# EAGLE design DropScreenMay2016DriversBoard (EAGLE 7.1.0)
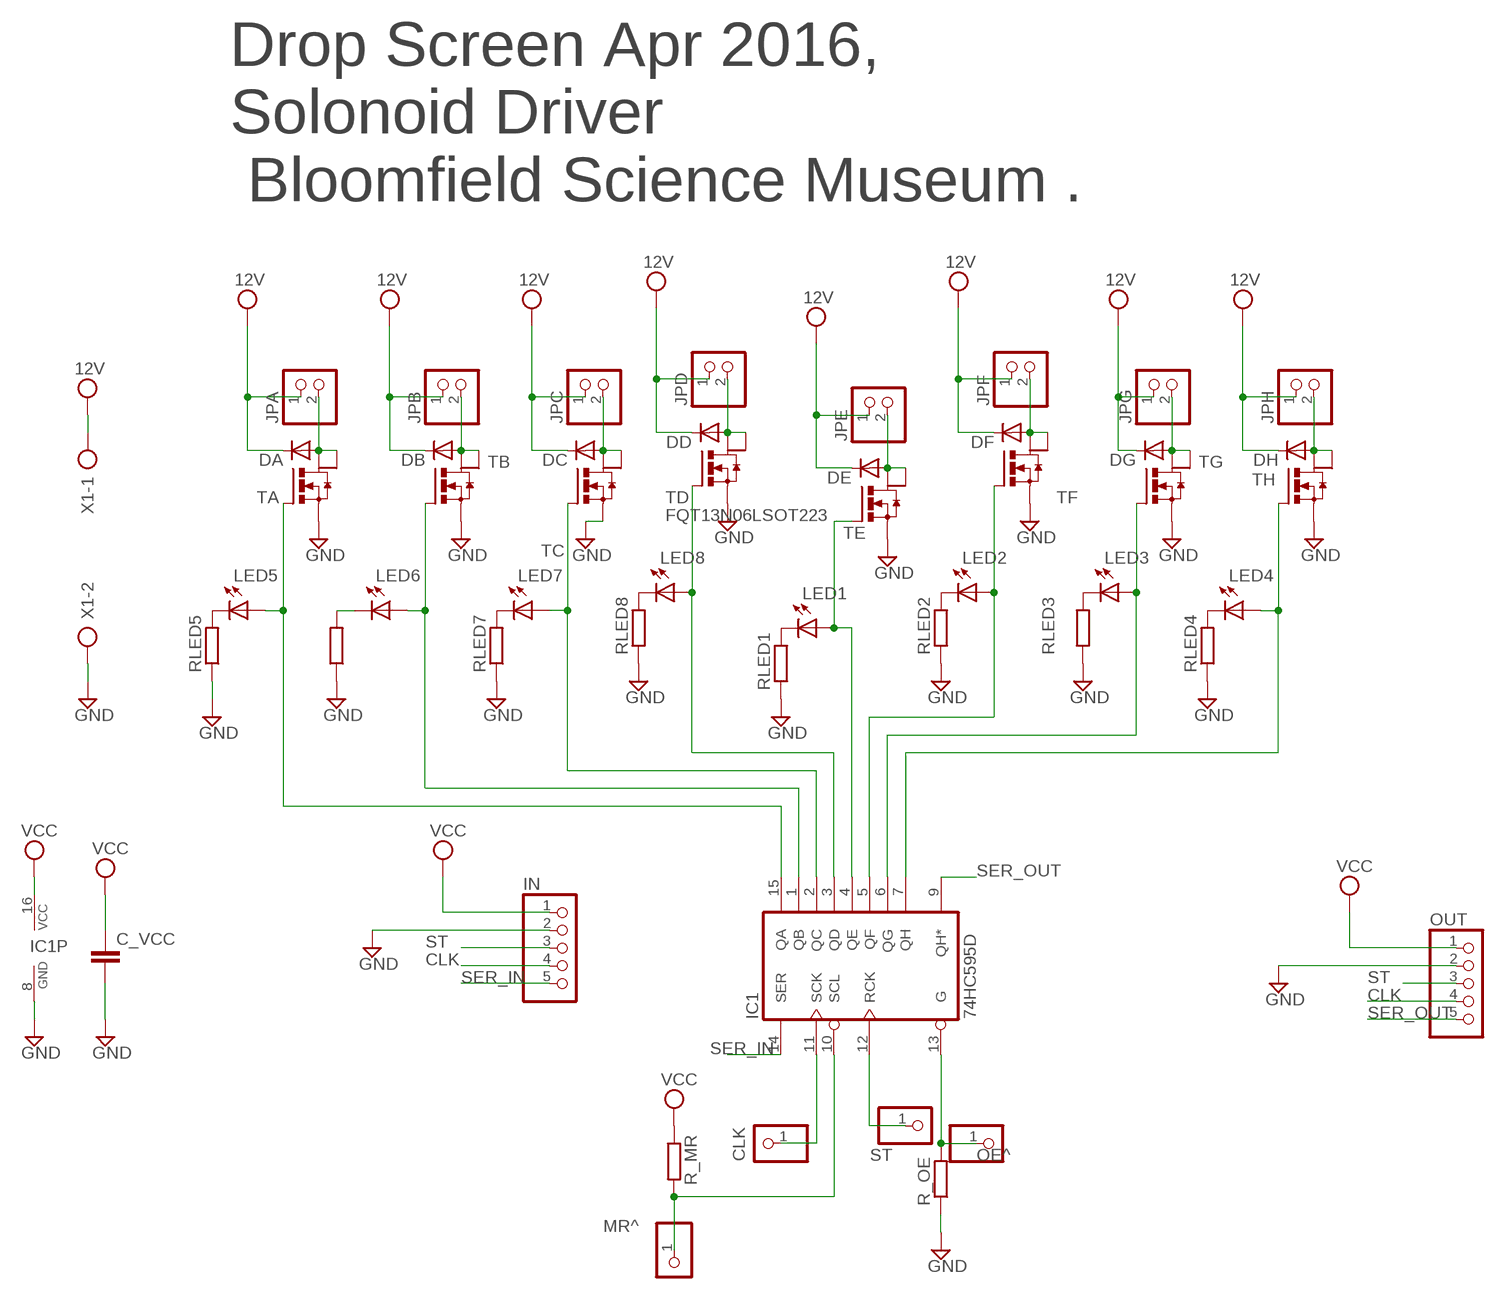
[diagram p0: schematic, sheet 1]

## Parts
C_VCC  C-EUC0805  [C0805]
CLK  PINHD-1X1  [1X01]
CLK1  PINHD-1X1  [1X01]
DA  1N4004V  [DO41-25]
DB  1N4004V  [DO41-25]
DC  1N4004V  [DO41-25]
DD  1N4004V  [DO41-25]
DE  1N4004V  [DO41-25]
DF  1N4004V  [DO41-25]
DG  1N4004V  [DO41-25]
DH  1N4004V  [DO41-25]
IC1  74HC595D  [SO16]
IN  PIN_HEAD_1X5_MARKEDSMAOLPAD  [1X5_MARKED_SMALL_PADS]
JPA  PINHD-1X2SQ&RND  [1X02_SQ&ROUND]
JPB  PINHD-1X2SQ&RND  [1X02_SQ&ROUND]
JPC  PINHD-1X2SQ&RND  [1X02_SQ&ROUND]
JPD  PINHD-1X2SQ&RND  [1X02_SQ&ROUND]
JPE  PINHD-1X2SQ&RND  [1X02_SQ&ROUND]
JPF  PINHD-1X2SQ&RND  [1X02_SQ&ROUND]
JPG  PINHD-1X2SQ&RND  [1X02_SQ&ROUND]
JPH  PINHD-1X2SQ&RND  [1X02_SQ&ROUND]
LED1  LEDCHIPLED_0805  [CHIPLED_0805]
LED2  LEDCHIPLED_0805  [CHIPLED_0805]
LED3  LEDCHIPLED_0805  [CHIPLED_0805]
LED4  LEDCHIPLED_0805  [CHIPLED_0805]
LED5  LEDCHIPLED_0805  [CHIPLED_0805]
LED6  LEDCHIPLED_0805  [CHIPLED_0805]
LED7  LEDCHIPLED_0805  [CHIPLED_0805]
LED8  LEDCHIPLED_0805  [CHIPLED_0805]
OE^  CLR  PINHD-1X1  [1X01]
OUT  PIN_HEAD_1X5_MARKEDSMAOLPAD  [1X5_MARKED_SMALL_PADS]
R_MR  R-EU_R0603  [R0603]
R_OE  R-EU_R0603  [R0603]
RLED1  R-EU_R0603  [R0603]
RLED2  R-EU_R0603  [R0603]
RLED3  R-EU_R0603  [R0603]
RLED4  R-EU_R0603  [R0603]
RLED5  R-EU_R0603  [R0603]
RLED6  R-EU_R0603  [R0603]
RLED7  R-EU_R0603  [R0603]
RLED8  R-EU_R0603  [R0603]
ST  ST  PINHD-1X1  [1X01]
TA  FQT13N06LSOT223  [SOT223]
TB  FQT13N06LSOT223  [SOT223]
TC  FQT13N06LSOT223  [SOT223]
TD  FQT13N06LSOT223  [SOT223]
TE  FQT13N06LSOT223  [SOT223]
TF  FQT13N06LSOT223  [SOT223]
TG  FQT13N06LSOT223  [SOT223]
TH  FQT13N06LSOT223  [SOT223]
X1  AK300/2  [AK300/2]

## Nets
12V: DA.C DB.C DC.C DD.C DE.C DF.C DG.C DH.C JPA.1 JPB.1 JPC.1 JPD.1 JPE.1 JPF.1 JPG.1 JPH.1 X1.1
+5V: C_VCC.1 IC1.16(VCC) IN.1 OUT.1 R_MR.1 ; supply symbol labelled VCC
CLK: CLK.1 IC1.11(SCK) IN.4 OUT.4
GND: C_VCC.2 IC1.8(GND) IN.2 OUT.2 R_OE.1 RLED1.1 RLED2.1 RLED3.1 RLED4.1 RLED5.1 RLED6.1 RLED7.1 RLED8.1 TA.3(S) TB.3(S) TC.3(S) TD.3(S) TE.3(S) TF.3(S) TG.3(S) TH.3(S) X1.2
MR^: CLK1.1 IC1.10(SCL) R_MR.2
N$1: IC1.4(QE) LED1.A TE.1(G)
N$2: DE.A JPE.2 TE.2(D) TE.4(D1)
N$3: LED1.C RLED1.2
N$5: DF.A JPF.2 TF.2(D) TF.4(D1)
N$13: DG.A JPG.2 TG.2(D) TG.4(D1)
N$14: LED2.C RLED2.2
N$15: DH.A JPH.2 TH.2(D) TH.4(D1)
N$18: DA.A JPA.2 TA.2(D) TA.4(D1)
N$19: LED5.C RLED5.2
N$20: LED4.C RLED4.2
N$21: DB.A JPB.2 TB.2(D) TB.4(D1)
N$24: DD.A JPD.2 TD.2(D) TD.4(D1)
N$26: LED6.C RLED6.2
N$27: LED3.C RLED3.2
N$28: LED7.C RLED7.2
N$29: DC.A JPC.2 TC.2(D) TC.4(D1)
N$32: LED8.C RLED8.2
OE^: IC1.13(G) OE^.1 R_OE.2
QA: IC1.15(QA) LED5.A TA.1(G)
QB: IC1.1(QB) LED6.A TB.1(G)
QC: IC1.2(QC) LED7.A TC.1(G)
QD: IC1.3(QD) LED8.A TD.1(G)
QF: IC1.5(QF) LED2.A TF.1(G)
QG: IC1.6(QG) LED3.A TG.1(G)
QH: IC1.7(QH) LED4.A TH.1(G)
SER_IN: IC1.14(SER) IN.5
SER_OUT: IC1.9(QH*) OUT.5
ST: IC1.12(RCK) IN.3 OUT.3 ST.1

## Notes on the sheet
- Drop Screen Apr 2016,
  Solonoid Driver
   Bloomfield Science Museum .

## Library data of the parts
C_VCC = rcl:C-EU: CAPACITOR, European symbol
CLK CLK1 OE^ ST = pinhead:PINHD-1X1: PIN HEADER
DA DB DC DD DE DF DG DH = Amir_May_15:1N4004: DIODE general purpose rectifier, 1 A
IC1 = 74xx-eu:74*595: 8-bit SHIFT REGISTER, output latch
IN OUT = Amir_May_15:PIN_HEAD_1X5_MARKED
JPA JPB JPC JPD JPE JPF JPG JPH = Amir_May_15:PINHD-1X2: PIN HEADER
LED1-LED8 = Amir_May_15:LED: LED OSRAM: - CHIPLED LG R971, LG N971, LY N971, LG Q971, LY Q971, LO R971, LY R971 LH N974, LH R974 LS Q976, LO Q976, LY Q976 LO Q996 - Hyper CHIPLED LW Q18S LB Q993, LB Q99A, LB R99A - SideLED LS A670, LO A670, LY A670, LG A670, LP A670 LB A673, LV A673, LT A673, LW A673 LH A674 LY A675 LS A676, LA A676, LO A676, LY A676, LW A676 LS A679, LY A679, LG A679 - Hyper Micro SIDELED® LS Y876, LA Y876, LO Y876, LY Y876 LT Y87S - SmartLED LW L88C, LW L88S LB L89C, LB L89S, LG L890 LS L89K, LO L89K, LY L89K LS L896, LA L896, LO L896, LY L896 - TOPLED LS T670, LO T670, LY T670, LG T670, LP T670 LSG T670, LSP T670, LSY T670, LOP T670, LYG T670 LG T671, LOG T671, LSG T671 LB T673, LV T673, LT T673, LW T673 LH T674 LS T676, LA T676, LO T676, LY T676, LB T676, LH T676, LSB T676, LW T676 LB T67C, LV T67C, LT T67C, LS T67K, LO T67K, LY T67K, LW E67C LS E67B, LA E67B, LO E67B, LY E67B, LB E67C, LV E67C, LT E67C LW T67C LS T679, LY T679, LG T679 LS T770, LO T770, LY T770, LG T770, LP T770 LB T773, LV T773, LT T773, LW T773 LH T774 LS E675, LA E675, LY E675, LS T675 LS T776, LA T776, LO T776, LY T776, LB T776 LHGB T686 LT T68C, LB T68C - Hyper Mini TOPLED® LB M676 - Mini TOPLED Santana® LG M470 LS M47K, LO M47K, LY M47K Source: http://www.osram.convergy.de/
R_MR R_OE RLED1-RLED8 = rcl:R-EU_: RESISTOR, European symbol
TA TB TC TD TE TF TG TH = Amir_May_15:FQT13N06L: Power Mos Fet N
X1 = Amir_Apr_16:AK300/2: CONNECTOR; OC_FARNELL: unknown; OC_NEWARK: unknown

## Board
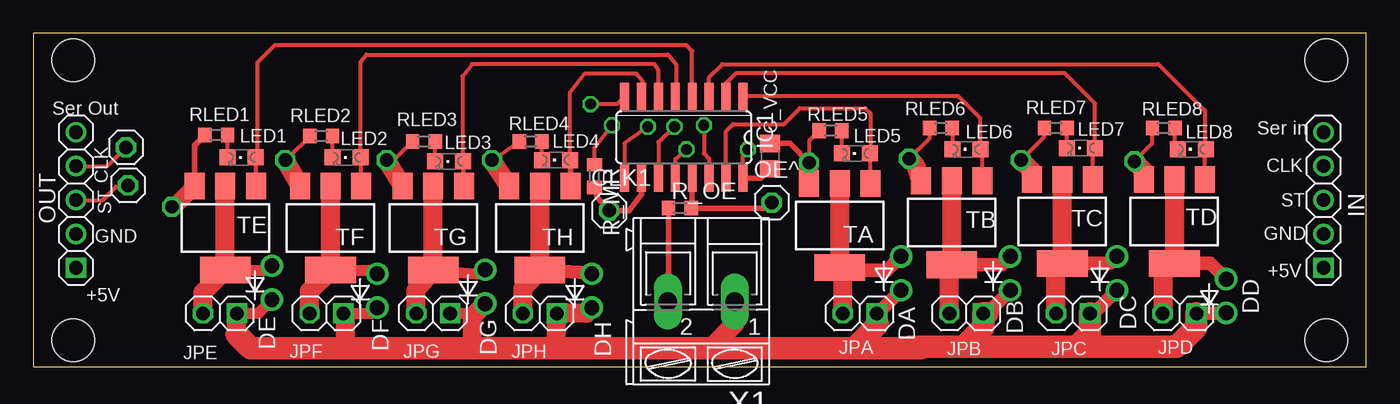
[diagram p1: board, top side]
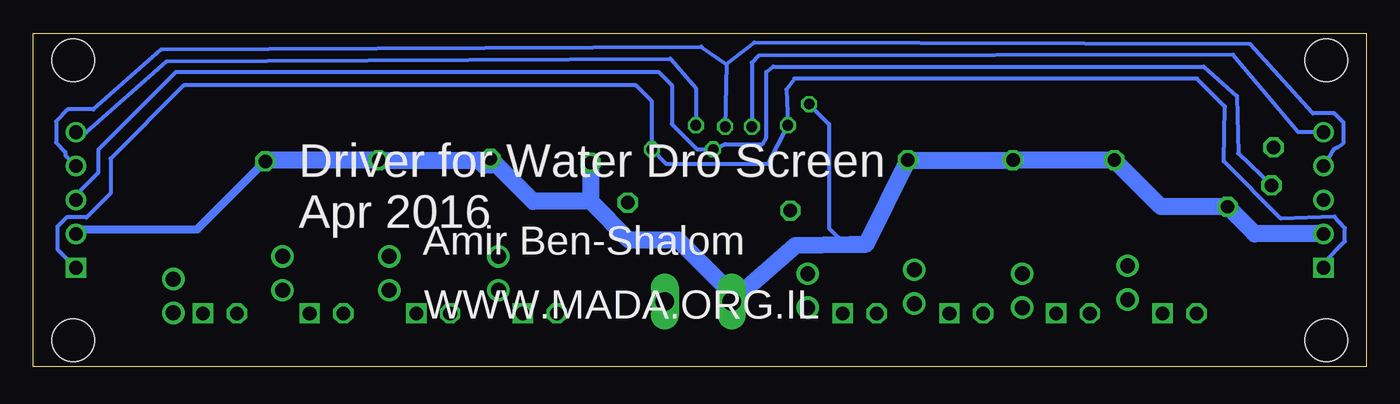
[diagram p2: board, bottom side, seen from below]

Size 100 x 25 mm. Coordinates in mm from the lower left corner, seen from the top.
Outline: 0,0 100,0 100,25 0,25 0,0
Copper layers (1*16): Top 0.035mm / dielectric 1.5mm / Bottom 0.035mm
Design rules "Smart-prototyping": minimum track width 7mil, minimum drill 12mil, track to track 7mil, track to pad 7mil, pad to pad 7mil, via to via 7mil, smd to smd 0mil, copper to edge 20mil, drill to drill 10mil, minimum pad ring 10mil, minimum via ring 6mil, stop-mask expansion 2mil, vias tented up to drill 25mil, thermal gap 10mil
Holes 3.2 mm at 97,2 97,23 3,23 3,2

### Footprints (pad centres in the part's own frame; a part is rotated, then mirrored left to right if it is on the bottom)
C0805 = smd 1.3 x 1.5: 1 -0.95,0; 2 0.95,0
1X01 = drill 1.016 octagon: 1 0,0
DO41-25 = drill 1.118: A 1.27,0; C -1.27,0
SO16 = smd 0.66 x 2.032: 1 -4.445,-3.073; 2 -3.175,-3.073; 3 -1.905,-3.073; 4 -0.635,-3.073; 5 0.635,-3.073; 6 1.905,-3.073; 7 3.175,-3.073; 8 4.445,-3.073; 9 4.445,3.073; 10 3.175,3.073; 11 1.905,3.073; 12 0.635,3.073; 13 -0.635,3.073; 14 -1.905,3.073; 15 -3.175,3.073; 16 -4.445,3.073
1X5_MARKED_SMALL_PADS = drill 1.016 square: 1 -5.08,0 | drill 1.016: 2 -2.54,0; 3 0,0; 4 2.54,0; 5 5.08,0
1X02_SQ&ROUND = drill 1.016 square: 1 -1.27,0 | drill 1.016 octagon: 2 1.27,0
CHIPLED_0805 = smd 1.2 x 1.2: A 0,-1.05; C 0,1.05
R0603 = smd 1 x 1.1: 1 -0.85,0; 2 0.85,0
SOT223 = smd 1.5 x 2: 1 -2.3,-3.15; 2 0,-3.15; 3 2.3,-3.15 | smd 3.8 x 2: 4 0,3.15
AK300/2 = drill 1.4 long: 1 -2.515,0; 2 2.489,0

### Placement (x,y rotation side)
C_VCC  55.28,15.8 90 top
CLK  6.95,16.45 0 top
CLK1  43.2,11.7 0 top
DA  65.1,7 90 top
DB  73.3,7 90 top
DC  81.3,7 90 top
DD  89.5,5.3 90 top
DE  17.9,6.3 90 top
DF  25.8,5.7 90 top
DG  33.9,6 90 top
DH  41.9,5.7 90 top
IC1  48.8,17.2 180 top
IN  96.8,12.5 90 top
JPA  62,4 180 top
JPB  70,4 180 top
JPC  78,4 180 top
JPD  86,4 180 top
JPE  14,4 180 top
JPF  22,4 180 top
JPG  30,4 180 top
JPH  38,4 180 top
LED1  15.64,15.7 90 top
LED2  23.5,15.7 90 top
LED3  31.2,15.4 90 top
LED4  39.2,15.5 90 top
LED5  61.7,16 90 top
LED6  70,16.3 90 top
LED7  78.6,16.4 90 top
LED8  86.9,16.3 90 top
OE^  55.4,12.3 0 top
OUT  3.2,12.5 90 top
R_MR  42.1,14.3 270 top
R_OE  48.5,11.9 0 top
RLED1  13.73,17.38 0 top
RLED2  21.6,17.3 0 top
RLED3  29.3,16.9 0 top
RLED4  37.3,16.9 0 top
RLED5  59.8,17.7 0 top
RLED6  68.1,17.9 0 top
RLED7  76.7,17.9 0 top
RLED8  84.8,17.9 0 top
ST  7.1,13.6 0 top
TA  60.5,10.6 180 top
TB  68.9,10.8 180 top
TC  77.2,10.9 180 top
TD  85.6,10.9 180 top
TE  14.4,10.4 180 top
TF  22.3,10.4 180 top
TG  30,10.4 180 top
TH  38,10.4 180 top
X1  50.1,4.9 180 top

### Tracks (layer width: path | path; a pad name or v marks a point on that pad's centre or on a via)
12V
  Top 0.813: JPE.1 16.87,4 DE.C | JPF.1 25.37,4 DF.C | JPG.1 33.17,4 DG.C
  Top 1.016: JPA.1 63.37,4 DA.C | 71.57,4 DB.C | JPC.1 79.57,4 DC.C | JPD.1 89.47,4 DD.C
  Top 1.422: 66.6,1.4 66.7,1.5 | 63.37,4 63.37,3.17 | X1.1 52.62,3.21 50.8,1.4 | 15.27,2.43 JPE.1 | JPF.1 23.4,3.87 23.4,1.4 | DG.C 32.9,3.73 32.9,1.4 | 39.2,1.4 39.2,3.93 JPH.1 41.47,4 DH.C
  Top 1.676: 79.2,1.5 85.8,1.5 87.27,2.97 JPD.1 | 79.2,1.5 78.3,1.5 | 78.3,1.5 71.3,1.5 | 71.3,1.5 69.8,1.5 | 69.8,1.5 66.7,1.5 65.77,1.5 | 79.27,1.57 79.2,1.5 | 71.27,1.53 71.3,1.5 | 15.27,2.43 16.3,1.4 23.4,1.4 32.9,1.4 39.2,1.4 50.8,1.4 61.6,1.4 | 61.6,1.4 66.6,1.4 | 71.57,4 JPB.1 71.27,2.97 69.8,1.5 | JPC.1 79.27,2.47 78.3,1.5 | 63.37,3.17 61.6,1.4
+5V  (via drill 0.8)
  Top 0.305: IC1.16 53.24,15.95 v53.6,16.3 | R_MR.1 42.1,16.4 v43.4,18.1
  Top 0.406: C_VCC.1 54.56,14.13 IC1.16
  Bottom 0.305: IN.1 98.2,8.82 98.2,10.5 97.5,11.2 96,11.2 94.2,13 94.2,15.6 88.7,21.1 54.8,21.1 53.6,19.9 v53.6,16.3 52.5,15.2 44.9,15.2 v43.4,18.1 43.5,20.8 42.9,21.6 12.7,21.6 10.6,19.5 10.7,15.4 6.4,11.1 2.39,11.25 1.6,10.4 1.6,9.4 3.2,7.8 OUT.1
CLK  (via drill 0.8)
  Top 0.305: OUT.4 5.54,15.04 CLK.1 | v48.1,18 46.9,16.83 IC1.11
  Bottom 0.305: 48,22.7 49.9,24 90.4,23.8 95.5,19.3 97.4,19.3 98.3,18.4 98.3,16.8 97.6,16.1 97.6,15.84 IN.4 | 48,22.7 v48.1,18 | 48,22.7 45.9,24.3 8.7,24.2 4,19 2.4,19 1.7,18.3 1.7,16.8 2.15,16.45 2.45,16.29 OUT.4
GND  (via drill 0.8, 1)
  Top 0.305: RLED5.1 58.2,16.95 v58.2,15.3 | v65.7,15.6 67.25,17.15 RLED6.1 | v74.1,15.5 75.85,17.25 RLED7.1 | v82.6,15.4 83.95,16.75 RLED8.1 | v18.9,15.5 19.2,15.75 RLED2.1 | v26.5,15.5 27.1,15.55 RLED3.1 | v34.4,15.5 34.4,15.45 RLED4.1 | IC1.8 43.78,19.7 v41.8,19.7
  Top 0.406: RLED1.1 12.1,16.6 TE.3 | C_VCC.2 56.75,16.75 v58.2,15.3 | R_OE.1 47.65,4.94 X1.2
  Top 1.27: TE.3 10.55,12 v10.4,12
  Top 1.422: TA.3 v58.2,15.3 | TB.3 66.2,15.1 v65.7,15.6 | TC.3 74.9,14.7 v74.1,15.5 | TD.3 83.3,14.7 v82.6,15.4 | TF.3 v18.9,15.5 | TG.3 v26.5,15.5 | TH.3 v34.4,15.5
  Bottom 0.305: v41.8,19.7 40.3,18.2 40.3,10.4 39.08,9.18 38.69,9.18
  Bottom 0.61: IN.2 96.46,10.3 87.7,10.3 v82.6,15.4
  Bottom 1.27: OUT.2 8.36,9.96 v10.4,12 15.4,12 v18.9,15.5 v26.5,15.5 v34.4,15.5 37.5,9.2 38.69,9.18 42.81,9.1 X1.2 | 58.2,12.4 55.3,9.5 51.6,9.5 47.61,5.51 | 58.2,15.1 58.2,12.4 | 58.2,12.4 62.51,12.4 v65.7,15.6 66.2,15.1 66.6,15.5 v74.1,15.5 82.5,15.5 v82.6,15.4
  Bottom 1.422: v58.2,15.3 58.2,15.1 | v65.7,15.6 65.7,15.2 | X1.2 47.61,5.51
MR^
  Top 0.406: R_MR.2 42.3,12.7 CLK1.1 44.7,11.7 45.62,12.93 IC1.10
N$1
  Top 0.305: IC1.4 49.44,23.66 49,24.1 18.1,24.1 16.8,22.8 16.8,15.81 LED1.A TE.1
N$2
  Top 0.813: TE.4 17.58,7.25 DE.A
  Top 1.422: JPE.2 12.73,5.58 TE.4 TE.2
N$3
  Top 0.305: LED1.C RLED1.2
N$5
  Top 0.813: TF.4 25.52,7.25 DF.A
  Top 1.422: JPF.2 20.73,5.68 TF.4 TF.2
N$13
  Top 0.813: TG.4 33.58,6.95 DG.A
  Top 1.422: JPG.2 28.73,5.78 TG.4 TG.2
N$14
  Top 0.305: LED2.C RLED2.2
N$15
  Top 1.016: TH.4 41.82,7.05 DH.A
  Top 1.422: JPH.2 36.73,5.88 TH.4 TH.2
N$18
  Top 1.016: 60.73,7.22 64.05,7.22 DA.A
  Top 1.422: JPA.2 60.73,7.22 TA.4 TA.2
N$19
  Top 0.305: LED5.C RLED5.2
N$20
  Top 0.305: LED4.C RLED4.2
N$21
  Top 1.016: TB.4 72.68,7.65 DB.A
  Top 1.422: JPB.2 68.73,7.48 TB.4 TB.2
N$24
  Top 1.016: TD.4 88.32,7.75 DD.A
  Top 1.422: TD.2 TD.4 84.73,6.88 JPD.2
N$26
  Top 0.305: RLED6.2 LED6.C
N$27
  Top 0.305: LED3.C RLED3.2
N$28
  Top 0.305: LED7.C RLED7.2
N$29
  Top 1.016: TC.4 80.78,7.75 DC.A
  Top 1.422: JPC.2 76.73,7.28 TC.4 TC.2
N$32
  Top 0.305: LED8.C 85.65,16.5 RLED8.2
OE^
  Top 0.406: IC1.13 49.44,11.98 R_OE.2 55,11.9 OE^.1
QA
  Top 0.305: TA.1 62.8,15.95 LED5.A 62.8,16.05 62.8,19 62.4,19.4 57.5,19.4 56.3,18.2 52.5,18.2 51.98,17.68 IC1.15
QB
  Top 0.305: TB.1 71.2,16.15 LED6.A 71.05,18.65 69.4,20.3 53.27,20.3 IC1.1
QC
  Top 0.305: TC.1 79.5,16.25 LED7.A 79.65,19.75 77.4,22 52.7,22 52,21.3 52,20.3 IC1.2
QD
  Top 0.305: TD.1 87.9,16.25 LED8.A 87.9,16.35 87.9,19.2 84.4,22.7 51.7,22.7 50.7,21.7 IC1.3
QF
  Top 0.305: TF.1 24.6,15.65 LED2.A 24.55,22.85 25,23.4 47.6,23.4 48.2,22.7 48.2,20.31 IC1.5
QG
  Top 0.305: IC1.6 46.9,22.2 46.6,22.7 32.9,22.7 32.2,21.8 32.2,15.45 LED3.A 32.25,13.3 TG.1
QH
  Top 0.305: LED4.A 40.25,20.55 41.4,22 45.2,22 45.7,21.4 45.7,20.35 IC1.7
  Top 0.406: TH.1 40.3,15.45 LED4.A
SER_IN  (via drill 0.8)
  Top 0.305: v50.3,18.1 50.3,16 50.7,15.6 IC1.14
  Bottom 0.305: IN.5 96.02,17.58 90,22.9 52.2,23.1 50.3,20.9 v50.3,18.1
SER_OUT  (via drill 0.8)
  Top 0.305: v46.1,18 44.35,16.75 IC1.9
  Bottom 0.305: OUT.5 5.1,17.6 10,23.4 45.6,23.3 46.1,22.8 v46.1,18
ST  (via drill 0.8)
  Top 0.305: OUT.3 5.2,12.5 6.2,13.5 7,13.5 ST.1 | IC1.12 48.16,15.56 v49,16.3
  Bottom 0.305: ST.1 9.6,16 9.7,20.3 12.2,22.5 44.5,22.5 45,22.1 45,17.2 45.3,16.7 48.1,16.7 v49,16.3 50.2,16.3 52.1,18.2 52.1,21.1 53.1,22.1 89.3,22.1 95.1,16.3 95.1,14.6 96.8,12.9 IN.3

### Text on the board
tNames: Ser Out | Ser in | CLK | ST | GND | GND | +5V | +5V
bNames: Driver for Water Dro Screen / Apr 2016 | Amir Ben-Shalom | WWW.MADA.ORG.IL